# EAGLE design opto_12ch (EAGLE 9.6.2)
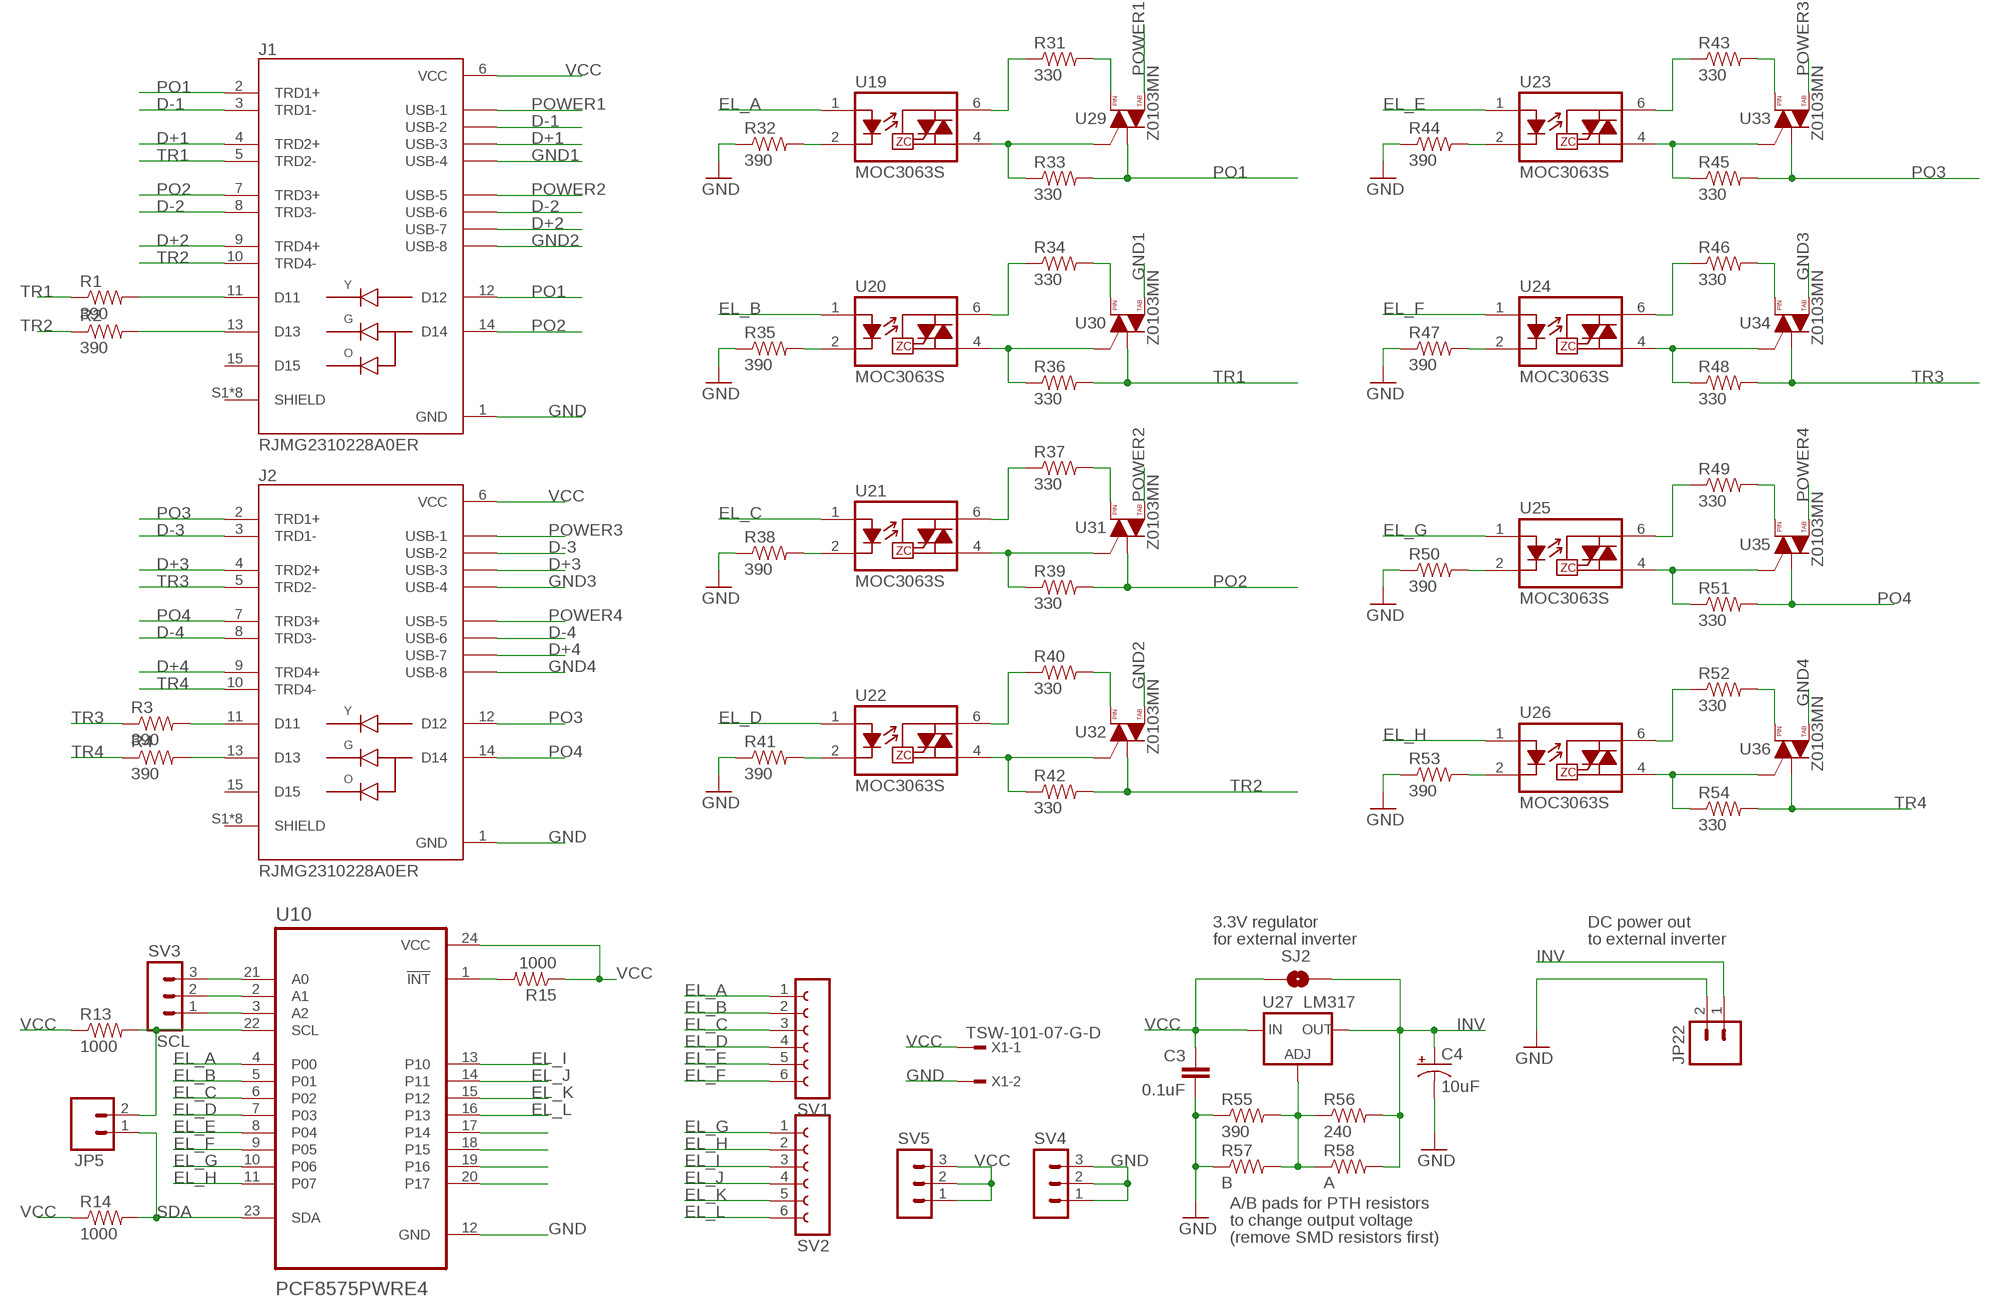
[diagram p0: schematic, sheet 1]

## Parts
C3  0.1uF  CAP0603-CAP  [0603-CAP]
C4  10uF  CAP_POL1206  [EIA3216]
J1  RJMG2310228A0ER  [AMPHENOL_RJMG2310228A0ER]
J2  RJMG2310228A0ER  [AMPHENOL_RJMG2310228A0ER]
JP5  M02PTH  [1X02]
JP22  M02PTH  [1X02]
R1  390  RESISTOR0603-RES  [0603-RES]
R2  390  RESISTOR0603-RES  [0603-RES]
R3  390  RESISTOR0603-RES  [0603-RES]
R4  390  RESISTOR0603-RES  [0603-RES]
R13  1000  RESISTOR0603-RES  [0603-RES]
R14  1000  RESISTOR0603-RES  [0603-RES]
R15  1000  RESISTOR0603-RES  [0603-RES]
R31  330  RESISTOR0603-RES  [0603-RES]
R32  390  RESISTOR0603-RES  [0603-RES]
R33  330  RESISTOR0603-RES  [0603-RES]
R34  330  RESISTOR0603-RES  [0603-RES]
R35  390  RESISTOR0603-RES  [0603-RES]
R36  330  RESISTOR0603-RES  [0603-RES]
R37  330  RESISTOR0603-RES  [0603-RES]
R38  390  RESISTOR0603-RES  [0603-RES]
R39  330  RESISTOR0603-RES  [0603-RES]
R40  330  RESISTOR0603-RES  [0603-RES]
R41  390  RESISTOR0603-RES  [0603-RES]
R42  330  RESISTOR0603-RES  [0603-RES]
R43  330  RESISTOR0603-RES  [0603-RES]
R44  390  RESISTOR0603-RES  [0603-RES]
R45  330  RESISTOR0603-RES  [0603-RES]
R46  330  RESISTOR0603-RES  [0603-RES]
R47  390  RESISTOR0603-RES  [0603-RES]
R48  330  RESISTOR0603-RES  [0603-RES]
R49  330  RESISTOR0603-RES  [0603-RES]
R50  390  RESISTOR0603-RES  [0603-RES]
R51  330  RESISTOR0603-RES  [0603-RES]
R52  330  RESISTOR0603-RES  [0603-RES]
R53  390  RESISTOR0603-RES  [0603-RES]
R54  330  RESISTOR0603-RES  [0603-RES]
R55  390  RESISTOR0603-RES  [0603-RES]
R56  240  RESISTOR0603-RES  [0603-RES]
R57  B  RESISTORPTH-1/4W  [AXIAL-0.4]
R58  A  RESISTORPTH-1/4W  [AXIAL-0.4]
SJ2  SOLDERJUMPERNO  [SJ_2S-NO]
SV1  FE06-1  [FE06]
SV2  FE06-1  [FE06]
SV3  MA03-1  [MA03-1]
SV4  MA03-1  [MA03-1]
SV5  MA03-1  [MA03-1]
U10  PCF8575PWRE4  [SOP65P640X120-24N]
U19  MOC3063S  [DIP8SMD]
U20  MOC3063S  [DIP8SMD]
U21  MOC3063S  [DIP8SMD]
U22  MOC3063S  [DIP8SMD]
U23  MOC3063S  [DIP8SMD]
U24  MOC3063S  [DIP8SMD]
U25  MOC3063S  [DIP8SMD]
U26  MOC3063S  [DIP8SMD]
U27  LM317  V_REG_317DPACK  [V-REG_DPACK]
U29  Z0103MN  TRIACSMD  [SOT223]
U30  Z0103MN  TRIACSMD  [SOT223]
U31  Z0103MN  TRIACSMD  [SOT223]
U32  Z0103MN  TRIACSMD  [SOT223]
U33  Z0103MN  TRIACSMD  [SOT223]
U34  Z0103MN  TRIACSMD  [SOT223]
U35  Z0103MN  TRIACSMD  [SOT223]
U36  Z0103MN  TRIACSMD  [SOT223]
X1  TSW-101-07-G-D  [TSW-101-XX-G-D]

## Nets
D+1: J1.4(TRD2+) J1.U13(USB-3)
D+2: J1.9(TRD4+) J1.U23(USB-7)
D+3: J2.4(TRD2+) J2.U13(USB-3)
D+4: J2.9(TRD4+) J2.U23(USB-7)
D-1: J1.3(TRD1-) J1.U12(USB-2)
D-2: J1.8(TRD3-) J1.U22(USB-6)
D-3: J2.3(TRD1-) J2.U12(USB-2)
D-4: J2.8(TRD3-) J2.U22(USB-6)
EL_A: SV1.1 U10.4(P00) U19.1(A)
EL_B: SV1.2 U10.5(P01) U20.1(A)
EL_C: SV1.3 U10.6(P02) U21.1(A)
EL_D: SV1.4 U10.7(P03) U22.1(A)
EL_E: SV1.5 U10.8(P04) U23.1(A)
EL_F: SV1.6 U10.9(P05) U24.1(A)
EL_G: SV2.1 U10.10(P06) U25.1(A)
EL_H: SV2.2 U10.11(P07) U26.1(A)
EL_I: SV2.3 U10.13(P10)
EL_J: SV2.4 U10.14(P11)
EL_K: SV2.5 U10.15(P12)
EL_L: SV2.6 U10.16(P13)
GND: C3.2 C4.C(-) J1.1(GND) J2.1(GND) JP22.2 R32.1 R35.1 R38.1 R41.1 R44.1 R47.1 R50.1 R53.1 R55.1 R57.P$1 SV4.1 SV4.2 SV4.3 U10.12(GND) X1.2
GND1: J1.U14(USB-4) U30.4(T2)
GND2: J1.U24(USB-8) U32.4(T2)
GND3: J2.U14(USB-4) U34.4(T2)
GND4: J2.U24(USB-8) U36.4(T2)
INV: C4.A(+) JP22.1 R56.2 R58.P$2 SJ2.2 U27.4(OUT)
N$18: J2.11(D11) R3.2
N$19: J2.13(D13) R4.2
N$23: SV3.3 U10.21(A0)
N$24: SV3.2 U10.2(A1)
N$25: SV3.1 U10.3(A2)
N$26: R15.2 U10.1(!INT)
N$27: J1.11(D11) R1.2
N$28: J1.13(D13) R2.2
N$39: U10.17(P14)
N$40: U10.18(P15)
N$41: U10.19(P16)
N$42: U10.20(P17)
N$44: R33.1 U19.4(T2) U29.3(G)
N$45: R32.2 U19.2(K)
N$46: R31.1 U19.6(T1)
N$48: R36.1 U20.4(T2) U30.3(G)
N$49: R35.2 U20.2(K)
N$50: R34.1 U20.6(T1)
N$52: R39.1 U21.4(T2) U31.3(G)
N$53: R38.2 U21.2(K)
N$54: R37.1 U21.6(T1)
N$56: R42.1 U22.4(T2) U32.3(G)
N$57: R41.2 U22.2(K)
N$58: R40.1 U22.6(T1)
N$60: R45.1 U23.4(T2) U33.3(G)
N$61: R44.2 U23.2(K)
N$62: R43.1 U23.6(T1)
N$64: R48.1 U24.4(T2) U34.3(G)
N$65: R47.2 U24.2(K)
N$66: R46.1 U24.6(T1)
N$68: R51.1 U25.4(T2) U35.3(G)
N$69: R50.2 U25.2(K)
N$70: R49.1 U25.6(T1)
N$72: R54.1 U26.4(T2) U36.3(G)
N$73: R53.2 U26.2(K)
N$74: R52.1 U26.6(T1)
N$76: R55.2 R56.1 R57.P$2 R58.P$1 U27.1(ADJ)
N$77: R31.2 U29.2(T2)
N$78: R34.2 U30.2(T2)
N$79: R37.2 U31.2(T2)
N$80: R40.2 U32.2(T2)
N$81: R43.2 U33.2(T2)
N$82: R46.2 U34.2(T2)
N$83: R49.2 U35.2(T2)
N$84: R52.2 U36.2(T2)
PO1: J1.2(TRD1+) J1.12(D12) R33.2 U29.1(T1)
PO2: J1.7(TRD3+) J1.14(D14) R39.2 U31.1(T1)
PO3: J2.2(TRD1+) J2.12(D12) R45.2 U33.1(T1)
PO4: J2.7(TRD3+) J2.14(D14) R51.2 U35.1(T1)
POWER1: J1.U11(USB-1) U29.4(T2)
POWER2: J1.U21(USB-5) U31.4(T2)
POWER3: J2.U11(USB-1) U33.4(T2)
POWER4: J2.U21(USB-5) U35.4(T2)
SCL: JP5.2 R13.2 U10.22(SCL)
SDA: JP5.1 R14.2 U10.23(SDA)
TR1: J1.5(TRD2-) R1.1 R36.2 U30.1(T1)
TR2: J1.10(TRD4-) R2.1 R42.2 U32.1(T1)
TR3: J2.5(TRD2-) R3.1 R48.2 U34.1(T1)
TR4: J2.10(TRD4-) R4.1 R54.2 U36.1(T1)
VCC: C3.1 J1.6(VCC) J2.6(VCC) R13.1 R14.1 R15.1 SJ2.1 SV5.1 SV5.2 SV5.3 U10.24(VCC) U27.3(IN) X1.1
Unconnected: J1.15(D15) J1.S1(SHIELD) J1.S2(SHIELD) J1.S3(SHIELD) J1.S4(SHIELD) J1.S5(SHIELD) J1.S6(SHIELD) J1.S7(SHIELD) J1.S8(SHIELD) J2.15(D15) J2.S1(SHIELD) J2.S2(SHIELD) J2.S3(SHIELD) J2.S4(SHIELD) J2.S5(SHIELD) J2.S6(SHIELD) J2.S7(SHIELD) J2.S8(SHIELD)

## Notes on the sheet
- 3.3V regulator | DC power out
- for external inverter | to external inverter
- A/B pads for PTH resistors
- to change output voltage
- (remove SMD resistors first)

## Library data of the parts
C3 = SparkFun:CAP: Capacitor Standard 0603 ceramic capacitor, and 0.1" leaded capacitor.
C4 = SparkFun:CAP_POL: Capacitor Polarized These are standard SMD and PTH capacitors. Normally 10uF, 47uF, and 100uF in electrolytic and tantalum varieties. Always verify the external diameter of the through hole cap, it varies with capacity, voltage, and manufacturer. The EIA devices should be standard.
J1 J2 = RJMG2310228A0ER:RJMG2310228A0ER: Check availability <https://pricing.snapeda.com/parts/RJMG2310228A0ER/Amphenol%20ICC/view-part?ref=eda>; AVAILABILITY: In Stock; DESCRIPTION: RJ Magnetic (RJMG) - Stacked, Input Output Connectors, Right angle, dip type, RJ45 + Over Dual USB 2.0,1000 baseT,Green/Green-Orange; MF: Amphenol ICC; MP: RJMG2310228A0ER; PACKAGE: None; PRICE: None; PURCHASE-URL: https://pricing.snapeda.com/search/part/RJMG2310228A0ER/?ref=eda
JP5 JP22 = SparkFun:M02: Header 2 Standard 2-pin 0.1" header. Use with straight break away headers (SKU : PRT-00116), right angle break away headers (PRT-00553), swiss pins (PRT-00743), machine pins (PRT-00117), and female headers (PRT-00115). Molex polarized connector foot print use with SKU : PRT-08233 with associated crimp pins and housings.
R1-R4 R13-R15 R31-R58 = SparkFun:RESISTOR: Resistor Basic schematic elements and footprints for 0603, 1206, and PTH resistors.
SJ2 = SparkFun:SOLDERJUMPER: Solder Jumper Standard SMD solder jumper. Used to automate production. Two varients : Normally Open and Normally Closed are the same, but have different paste layers. NC will have a large amount of paste and should jumper during reflow.
SV1 SV2 = con-lsta:FE06-1: FEMALE HEADER; OC_FARNELL: unknown; OC_NEWARK: unknown
SV3-SV5 = con-lstb:MA03-1: PIN HEADER; OC_FARNELL: unknown; OC_NEWARK: unknown
U10 = PCF8575PWRE4:PCF8575PWRE4: Check availability <https://pricing.snapeda.com/parts/PCF8575PWRE4/Texas%20Instruments/view-part?ref=eda>; AVAILABILITY: In Stock; DESCRIPTION: Remote 16-Bit I2C and SMBus I/O Expander with Interrupt Output 24-TSSOP -40 to 85; MF: Texas Instruments; MP: PCF8575PWRE4; PACKAGE: TSSOP-24 Texas Instruments; PRICE: None; PURCHASE-URL: https://pricing.snapeda.com/search/part/PCF8575PWRE4/?ref=eda
U19-U26 = mike-temp:MOC3063*: Optotriac in DIP and SMD LED: Vf: 1.2V If: 5 mA TRIAC Vdrm: 600V Itsm: 1A Viso: 5000V DV/dt: 1500V/us DIP: MOC3063 SMD: MOC3063S
U27 = SparkFun:V_REG_317: Voltage Regulator Standard LM317 adjustable voltage regulator. AOI (Adjust Output Input). Google 'LM317 Calculator' for easy to use app to get the two resistor values needed. 240/720 for 5V output. 240/390 for 3.3V output. Spark Fun Electronics SKU : COM-00527
U29-U36 = mike-temp:TRIAC
X1 = con-samtec:TSW-101-*-G: THROUGH-HOLE .025" SQ POST HEADER Source: Samtec TSW.pdf; MF: Samtec Inc.; MPN: TSW-101-07-G-D

## Net classes
0 Default: width 0.203 mm

## Board
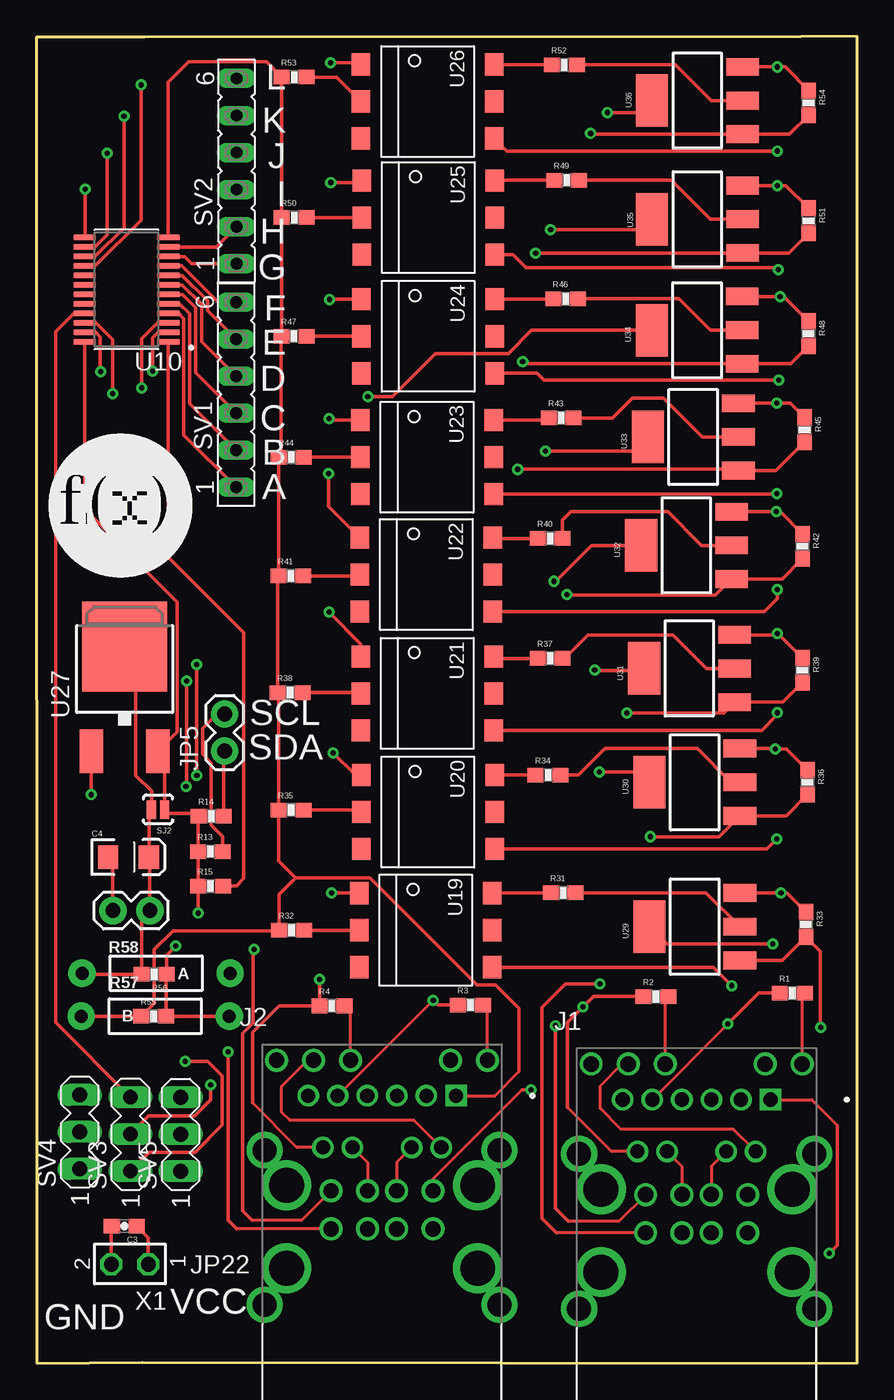
[diagram p1: board, top side]
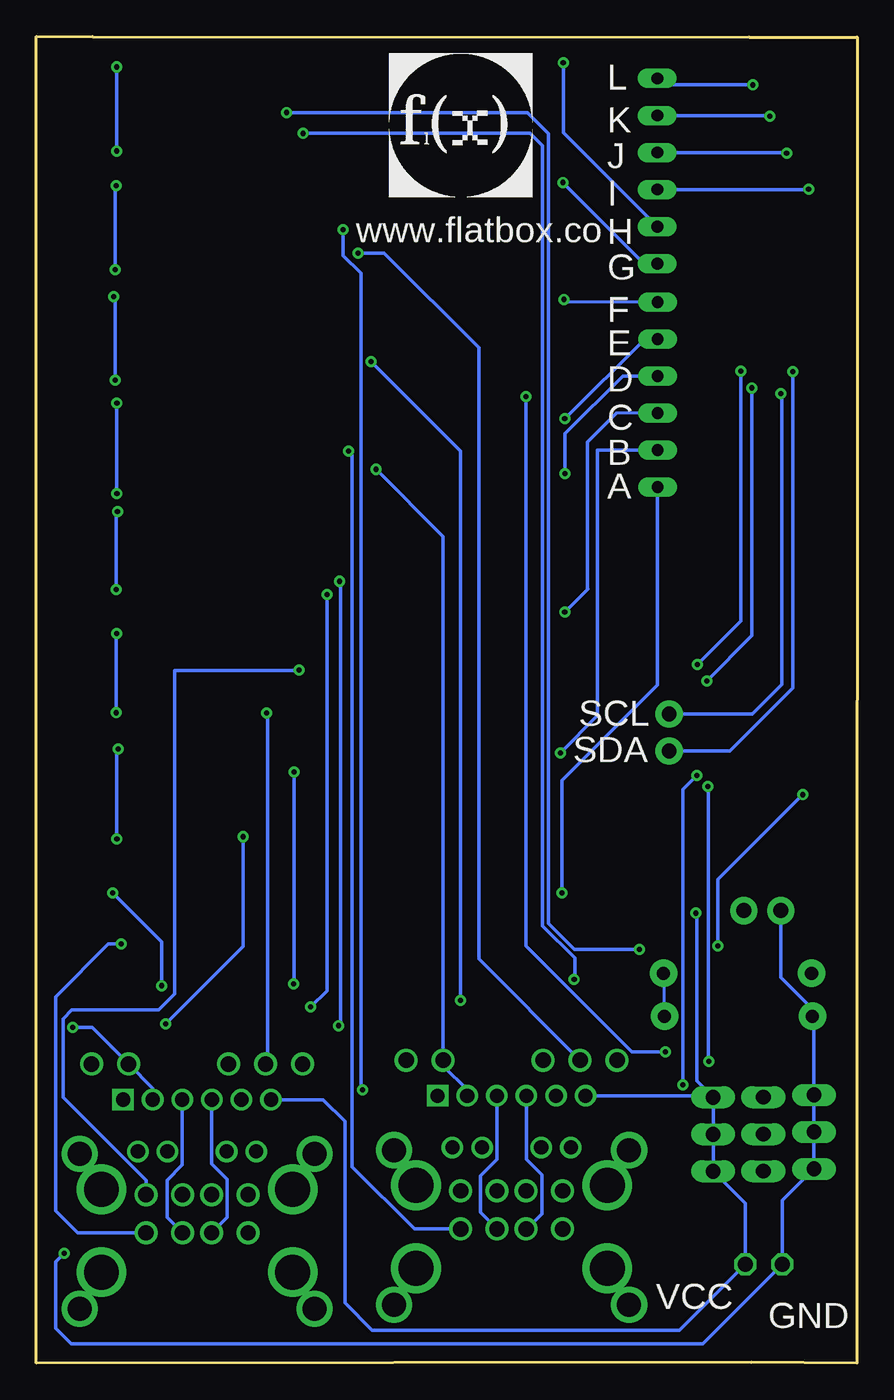
[diagram p2: board, bottom side, seen from below]

Size 56.34 x 91.03 mm. Coordinates in mm from the lower left corner, seen from the top.
Outline: 56.34,0 56.34,91.03 52.48,91.02 7.42,91 0,91 0.03,0 7.28,0.05 56.34,0
Copper layers (1*16): Top 0.035mm / dielectric 1.5mm / Bottom 0.035mm
Design rules "default": minimum track width 6mil, minimum drill 0.35mm, track to track 6mil, track to pad 6mil, pad to pad 6mil, via to via 6mil, smd to smd 6mil, copper to edge 40mil, drill to drill 6mil, minimum pad ring 10mil, minimum via ring 8mil, stop-mask expansion 4mil, vias tented up to drill 0mil, thermal gap 10mil

### Footprints (pad centres in the part's own frame; a part is rotated, then mirrored left to right if it is on the bottom)
0603-CAP = smd 1.1 x 1: 1 -0.85,0; 2 0.85,0
EIA3216 = smd 1.4 x 1.6: A 1.4,0; C -1.4,0
AMPHENOL_RJMG2310228A0ER = drill 0.97 square: 1 5.075,6.15 | drill 0.97: 2 3.045,6.15; 3 1.015,6.15; 4 -1.015,6.15; 5 -3.045,6.15; 6 -5.075,6.15; 7 4.06,2.6; 8 2.03,2.6; 9 -2.03,2.6; 10 -4.06,2.6 | drill 1.05: 11 7.24,8.59; 12 4.7,8.59; 13 -2.16,8.59; 14 -4.7,8.59; 15 -7.24,8.59; U11 3.5,-2.99; U12 1,-2.99; U13 -1,-2.99; U14 -3.5,-2.99; U21 3.5,-0.37; U22 1,-0.37; U23 -1,-0.37; U24 -3.5,-0.37 | drill 1.65 pad 2: S1 -8.065,-8.2; S2 8.065,-8.2; S3 -8.065,2.42; S4 8.065,2.42 | drill 2.39 pad 2.74: S5 -6.565,-5.69; S6 6.565,-5.69; S7 -6.565,0; S8 6.565,0
1X02 = drill 1.016 pad 1.88: 1 0,0; 2 2.54,0
0603-RES = smd 1.1 x 1: 1 -0.85,0; 2 0.85,0
AXIAL-0.4 = drill 0.9 pad 1.88: P$1 -5.08,0; P$2 5.08,0
SJ_2S-NO = smd 0.635 x 1.27: 1 -0.45,0; 2 0.45,0
FE06 = drill 0.813 long: 1 -6.35,0; 2 -3.81,0; 3 -1.27,0; 4 1.27,0; 5 3.81,0; 6 6.35,0
MA03-1 = drill 1.016 long: 1 -2.54,0; 2 0,0; 3 2.54,0
SOP65P640X120-24N = smd 1.57 x 0.41: 1 -2.87,3.575; 2 -2.87,2.925; 3 -2.87,2.275; 4 -2.87,1.625; 5 -2.87,0.975; 6 -2.87,0.325; 7 -2.87,-0.325; 8 -2.87,-0.975; 9 -2.87,-1.625; 10 -2.87,-2.275; 11 -2.87,-2.925; 12 -2.87,-3.575; 13 2.87,-3.575; 14 2.87,-2.925; 15 2.87,-2.275; 16 2.87,-1.625; 17 2.87,-0.975; 18 2.87,-0.325; 19 2.87,0.325; 20 2.87,0.975; 21 2.87,1.625; 22 2.87,2.275; 23 2.87,2.925; 24 2.87,3.575
DIP8SMD = smd 1.524 x 1.27: 1 -2.54,-4.572; 2 0,-4.572; 3 2.54,-4.572; 4 2.54,4.572; 5 0,4.572; 6 -2.54,4.572
V-REG_DPACK = smd 1.6 x 3: 1 -2.28,-4.8; 3 2.28,-4.8 | smd 5.8 x 6.2: 4 0,2.38
SOT223 = smd 1.219 x 2.235: 1 -2.311,-3.099; 2 0,-3.099; 3 2.311,-3.099 | smd 3.6 x 2.2: 4 0,3.099
TSW-101-XX-G-D = drill 1 pad 1.5 octagon: 1 0.02,-1.27; 2 0.02,1.27

### Placement (x,y rotation side)
C3  6.03,9.41 180 top
C4  6.32,34.72 0 top
J1  45.31,11.93 0 top
J2  23.72,12.19 0 top
JP5  12.92,42 90 top
JP22  7.79,31.05 180 top
R1  51.88,25.39 0 top
R2  42.52,25.15 0 top
R3  29.79,24.57 0 top
R4  20.28,24.51 0 top
R13  11.94,35.1 0 top
R14  12,37.53 0 top
R15  11.95,32.73 0 top
R31  36.16,32.27 0 top
R32  17.51,29.71 0 top
R33  52.82,30.1 270 top
R34  35.12,40.35 0 top
R35  17.48,37.95 0 top
R36  52.92,39.85 270 top
R37  35.27,48.36 0 top
R38  17.41,46.01 0 top
R39  52.58,47.54 270 top
R40  35.27,56.59 0 top
R41  17.46,54.01 0 top
R42  52.58,56.05 270 top
R43  36.02,64.86 0 top
R44  17.49,62.15 0 top
R45  52.72,64.05 270 top
R46  36.32,73.03 0 top
R47  17.68,70.46 0 top
R48  52.98,70.64 270 top
R49  36.4,81.17 0 top
R50  17.69,78.61 0 top
R51  53,78.38 270 top
R52  36.23,89.08 0 top
R53  17.69,88.24 0 top
R54  53,86.47 270 top
R55  8.05,23.8 0 top
R56  8.08,26.68 180 top
R57  8.15,23.8 0 top
R58  8.22,26.75 180 top
SJ2  8.34,37.99 180 top
SV1  13.7,66.46 90 top
SV2  13.73,81.8 90 top
SV3  6.45,15.71 90 top
SV4  2.97,15.86 90 top
SV5  9.89,15.7 90 top
U10  6.18,73.66 180 top
U19  26.72,29.71 270 top
U20  26.87,37.81 270 top
U21  26.82,45.95 270 top
U22  26.76,54.11 270 top
U23  26.81,62.16 270 top
U24  26.89,70.46 270 top
U25  26.9,78.6 270 top
U26  26.85,86.57 270 top
U27  6.06,46.79 0 top
U29  45.18,29.95 90 top
U30  45.18,39.85 90 top
U31  44.81,47.66 90 top
U32  44.6,56.11 90 top
U33  45.07,63.55 90 top
U34  45.34,70.88 90 top
U35  45.35,78.49 90 top
U36  45.35,86.63 90 top
X1  6.41,6.76 90 top

### Tracks (layer width: path | path; a pad name or v marks a point on that pad's centre or on a via)
D+1
  Bottom 0.254: J1.4 44.3,14.95 44.3,13.66 43.25,12.61 43.25,10 J1.U13
D+2
  Top 0.203: J1.9 44.31,13.49 J1.U23
D+3
  Bottom 0.254: J2.U13 22.69,9.2 21.66,10.24 21.66,12.91 22.71,13.97 J2.4
D+4
  Top 0.203: J2.9 22.72,13.76 J2.U23
D-1
  Bottom 0.254: J1.3 46.33,14.95 46.33,13.61 47.38,12.56 47.38,10 J1.U12
D-2
  Top 0.203: J1.8 46.31,13.49 J1.U22
D-3
  Bottom 0.254: J2.U12 25.87,10.34 25.87,12.85 24.74,13.98 J2.3
D-4
  Top 0.203: J2.8 24.72,13.76 J2.U22
EL_A  (via drill 0.35)
  Top 0.254: U10.4 9.08,72.01 9.79,72.01 10.12,71.68 10.12,63.69 SV1.1 | U19.1 20.27,32.24 v20.26,32.26
  Bottom 0.254: SV1.1 13.7,46.52 20.26,39.96 v20.26,32.26
EL_B  (via drill 0.35)
  Top 0.254: SV1.2 10.53,65.83 10.53,72 9.81,72.71 9.08,72.71 U10.5 | U20.1 21.89,40.35 v20.37,41.87
  Bottom 0.254: SV1.2 17.82,62.65 17.82,44.42 v20.37,41.87
EL_C  (via drill 0.35)
  Top 0.254: SV1.3 10.93,67.96 10.93,72.42 10.04,73.31 9.08,73.31 U10.6 | U21.1 22.25,49.35 v20.08,51.52
  Bottom 0.203: SV1.3 16.52,65.19 | 18.5,53.14 18.48,53.12
  Bottom 0.254: 18.48,53.12 v20.08,51.52 | 16.52,65.19 18.5,63.21 18.5,53.14
EL_D  (via drill 0.35)
  Top 0.254: SV1.4 11.34,70.09 11.34,72.65 10.02,73.97 9.07,73.97 U10.7 | v20.05,61.05 20.05,58.78 U22.1
  Bottom 0.254: SV1.4 16.09,67.73 20.06,63.76 v20.06,61.05 v20.05,61.05
EL_E  (via drill 0.35)
  Top 0.254: SV1.5 11.74,72.23 11.74,72.89 10,74.63 U10.8 | U23.1 20.18,64.7 v20.08,64.81
  Bottom 0.254: v20.08,64.81 20.05,64.81 14.59,70.27 SV1.5
EL_F  (via drill 0.35)
  Top 0.254: SV1.6 12.48,72.81 9.98,75.31 9.08,75.31 U10.9 | U24.1 20.14,73 v20.13,72.99
  Bottom 0.203: SV1.6 19.95,72.81 v20.13,72.99
  Bottom 0.254: v20.13,72.99 20.13,73.14
EL_G  (via drill 0.35)
  Top 0.254: SV2.1 10.64,75.45 10.16,75.93 U10.10 | U25.1 22.2,81.01 v20.21,81.01
  Bottom 0.254: v20.21,81.01 14.64,75.45 SV2.1
EL_H  (via drill 0.35)
  Top 0.254: SV2.2 12.32,76.58 U10.11 | U26.1 22.15,89.23 v20.18,89.23
  Bottom 0.254: v20.18,89.23 20.18,84.44 SV2.2
EL_I  (via drill 0.35)
  Top 0.254: v3.34,80.54 3.34,77.26 U10.13
  Bottom 0.254: SV2.3 3.35,80.53 v3.34,80.54
EL_J  (via drill 0.35)
  Top 0.254: U10.14 3.34,76.56 4,76.56 4.85,77.42 v4.85,83.03
  Bottom 0.254: SV2.4 4.89,83.07 v4.85,83.03
EL_K  (via drill 0.35)
  Top 0.254: U10.15 3.33,75.92 4.01,75.92 6.01,77.92 v6.01,85.56
  Bottom 0.254: SV2.5 6.06,85.61 v6.01,85.56
EL_L  (via drill 0.35)
  Top 0.254: U10.16 3.33,75.3 4.03,75.3 7.18,78.44 v7.18,87.71
  Bottom 0.254: SV2.6 13.28,87.71 v7.18,87.71
GND  (via drill 0.35)
  Top 0.203: J2.1 31.46,18.34 33.13,20.01 | J1.1 53.22,18.07 54.98,16.32 | 16.83,78.6 R50.1
  Top 0.254: X1.2 5.14,9.37 C3.2 | R57.P$1 R55.1 8.1,24.7 8.1,28.37 9.39,29.66 16.62,29.66 R32.1 16.66,32.15 17.8,33.29 | JP22.2 5.25,34.4 C4.C | R50.1 R53.1 15.8,89.28 10.44,89.28 9.05,87.9 U10.12 | 33.13,20.01 33.13,24.35 31.52,25.96 30.23,25.96 22.9,33.29 17.8,33.29 | 17.8,33.29 16.63,34.46 R35.1 16.63,45.94 R38.1 16.56,53.96 R41.1 16.61,62.13 R44.1 16.8,62.32 16.8,70.44 R47.1 16.83,78.6 | 54.98,16.32 54.98,8.09 v54.42,7.53
  Bottom 0.254: JP22.2 5.25,26.48 3.07,24.31 R57.P$1 2.97,23.7 SV4.3 SV4.2 SV4.1 5.14,11.15 X1.2 10.59,1.33 53.95,1.33 55,2.39 55,6.95 v54.42,7.53
GND1  (via drill 0.35)
  Top 0.203: J1.U14 35.71,8.93
  Top 0.254: U30.4 41.37,40.56 v38.65,40.56 | v38.68,26.01 36.32,26.01 34.71,24.4 34.71,9.93 35.71,8.93
  Bottom 0.254: v38.65,40.56 38.65,26.05 v38.68,26.01
GND2  (via drill 0.35)
  Top 0.203: J1.U24 39.97,9.72 36.53,9.72
  Top 0.254: U32.4 38.1,56.11 35.64,53.64 v35.52,53.64 | 36.53,9.72 35.61,10.63 v35.61,23.15
  Bottom 0.254: v35.52,53.64 35.46,53.58 35.46,23.3 v35.61,23.15
GND3  (via drill 0.35)
  Top 0.203: J2.U14 13.75,9.2
  Top 0.254: U34.4 33.99,70.88 32.39,69.28 27.41,69.28 24.43,66.31 v22.75,66.31 | 13.75,9.2 13.17,9.78 v13.17,21.35
  Bottom 0.254: v13.17,21.35 13.18,21.34 15.48,21.34 22.75,28.61 v22.75,66.31
GND4  (via drill 0.35)
  Top 0.203: J2.U24 18.19,9.79 14.8,9.79
  Top 0.254: U36.4 41.44,85.81 v39.18,85.81 | v14.95,28.38 14.88,28.32 14.88,23.36 14.14,22.62 14.14,10.45 14.8,9.79
  Bottom 0.254: v39.18,85.81 22.64,85.81 21.21,84.38 21.21,30.18 19.41,28.38 v14.95,28.38
INV
  Top 0.254: R58.P$2 3.2,26.68 R56.2 7.23,30.49 JP22.1 7.79,34.66 C4.A 7.72,37.82 SJ2.2 7.89,39.24 6.83,40.31 6.83,48.4 U27.4
N$18
  Top 0.203: J2.11 30.96,24.25 R3.2
N$19
  Top 0.203: J2.13 21.56,24.08
  Top 0.254: 21.56,24.08 R4.2
N$23
  Top 0.254: SV3.3 1.32,23.38 1.32,70.77 2.58,72.03 U10.21 | U10.21
N$24  (via drill 0.35)
  Top 0.254: SV3.2 7.7,16.95 10.85,16.95 11.96,18.07 v11.96,19.1 | v11.01,40.31 10.99,40.33 v10.99,47.93 v10.98,47.93 | v7.99,68.06 7.99,70.38 8.35,70.73 U10.2 | U10.2
  Bottom 0.254: v11.96,19.1 11.96,39.36 v11.01,40.31 | v10.98,47.93 7.99,50.92 v7.99,68.06
N$25  (via drill 0.35)
  Top 0.254: U10.3 9.04,71.4 8.31,71.4 7.23,70.31 v7.23,66.92 | v10.32,46.81 10.32,39.63 v10.26,39.57 | SV3.1 7.75,14.46 10.9,14.46 12.76,16.33 12.76,19.7 11.75,20.71 v10.2,20.71
  Bottom 0.254: v7.23,66.92 7.23,49.91 v10.32,46.81 | v10.26,39.57 10.23,39.54 10.23,20.75 v10.2,20.71
N$26
  Top 0.254: U10.1 9.04,70.07 9.04,55.33 14.24,50.13 14.24,33.24 13.73,32.73 R15.2
N$27
  Top 0.203: J1.11 52.55,25.21 52.72,25.37
  Top 0.254: 52.63,25.29 52.72,25.37 R1.2
N$28
  Top 0.203: J1.13 43.15,24.93
  Top 0.254: 43.15,24.93 R2.2
N$44  (via drill 0.35)
  Top 0.254: U29.3 v51.1,32.26 51.51,32.26 R33.1 | U19.4 46.47,27.16 v47.74,25.89
  Bottom 0.254: v47.74,25.89 47.74,28.89 v51.1,32.26
N$45
  Top 0.254: R32.2 U19.2
N$46
  Top 0.254: U19.6 35.28,32.24 R31.1
N$48  (via drill 0.35)
  Top 0.254: U30.3 50.7,42.16 v50.72,42.14 51.48,42.14 R36.1 | U20.4 50.12,35.27 v50.81,35.97
  Bottom 0.254: v50.81,35.97 50.81,42.05 v50.72,42.14
N$49
  Top 0.254: R35.2 22.16,37.95 U20.2
N$50
  Top 0.254: R34.1 U20.6
N$52  (via drill 0.35)
  Top 0.254: U31.3 50.75,49.97 v50.84,50.06 50.9,50.06 R39.1 | v50.85,44.63 50.85,44.49 49.78,43.41 U21.4
  Bottom 0.254: v50.85,44.63 50.85,50.05 v50.84,50.06
N$53
  Top 0.254: R38.2 22.2,46.01 U21.2
N$54
  Top 0.254: R37.1 31.53,48.36 U21.6
N$56  (via drill 0.35)
  Top 0.254: U32.3 v50.77,58.42 51.05,58.42 R42.1 | v50.85,53.07 50.85,52.46 49.96,51.57 U22.4
  Bottom 0.254: v50.77,58.42 50.85,58.34 v50.85,53.07
N$57
  Top 0.254: U22.2 22.09,54.01 R41.2
N$58
  Top 0.254: R40.1 31.39,56.59 U22.6
N$60  (via drill 0.35)
  Top 0.254: U33.3 v50.81,65.86 51.75,65.86 R45.1 | v50.81,59.66 50.77,59.62 U23.4
  Bottom 0.254: v50.81,65.86 v50.81,59.66
N$61
  Top 0.254: U23.2 22.23,62.15 R44.2
N$62
  Top 0.254: R43.1 35.01,64.7 U23.6
N$64  (via drill 0.35)
  Top 0.254: U34.3 v51.04,73.19 51.28,73.19 R48.1 | U24.4 34.37,67.92 34.84,67.45 50.93,67.45 v50.94,67.46
  Bottom 0.254: v50.94,67.46 50.94,73.09 v51.04,73.19
N$65
  Top 0.254: R47.2 U24.2
N$66
  Top 0.254: U24.6 35.45,73 R46.1
N$68  (via drill 0.35)
  Top 0.254: U35.3 v50.86,80.8 51.43,80.8 R51.1 | U25.4 32.72,76.06 33.59,75.18 50.77,75.18 v50.93,75.03
  Bottom 0.254: v50.93,75.03 50.93,80.73 v50.86,80.8
N$69
  Top 0.254: R50.2 U25.2
N$70
  Top 0.254: R49.1 31.49,81.17 U25.6
N$72  (via drill 0.35)
  Top 0.254: U36.3 v50.84,88.94 51.38,88.94 R54.1 | U26.4 32.3,83.15 50.81,83.15 v50.84,83.17
  Bottom 0.254: v50.84,83.17 v50.84,88.94
N$73
  Top 0.254: R53.2 20.6,88.24 U26.2
N$74
  Top 0.254: U26.6 35.35,89.11 R52.1
N$76  (via drill 0.35)
  Top 0.254: R57.P$2 R55.2 8.9,26.66 R56.1 8.93,27.99 v9.56,28.63 | v3.75,39 3.75,41.95 U27.1
  Bottom 0.203: R57.P$2 13.23,26.68 R58.P$1
  Bottom 0.254: v9.56,28.63 9.56,33.18 v3.75,39
N$77
  Top 0.254: R31.2 45.95,32.27 U29.2
N$78
  Top 0.254: R34.2 37.19,40.35 39.01,42.16 45.36,42.16 47.67,39.85 U30.2
N$79
  Top 0.254: R37.2 36.26,48.36 37.84,49.95 43.68,49.95 45.96,47.66 U31.2
N$80
  Top 0.254: R40.2 36.12,57.84 36.7,58.42 43.33,58.42 45.63,56.11 U32.2
N$81
  Top 0.254: R43.2 39.53,64.86 40.9,66.23 43.03,66.23 45.71,63.55 U33.2
N$82
  Top 0.254: R46.2 44.11,73.02 46.26,70.88 U34.2
N$83
  Top 0.254: R49.2 43.56,81.17 46.24,78.49 U35.2
N$84
  Top 0.254: R52.2 43.87,89.08 46.32,86.63 U36.2
PO1  (via drill 0.35)
  Top 0.254: U29.1 51.2,27.63 R33.2 53.81,28.25 53.81,23.05 v53.84,23.02
  Bottom 0.254: J1.2 48.36,18.86 J1.12 52.52,23.02 v53.84,23.02
PO2  (via drill 0.35)
  Top 0.203: J1.7 47.85,16.05 40.11,16.05 38.7,17.46 38.7,19.01 40.2,20.51 J1.14
  Top 0.254: R39.2 51.24,45.35 U31.1 47.17,44.61 v40.54,44.61
  Bottom 0.254: v40.54,44.61 40.47,44.55 40.47,20.65 J1.14
PO3  (via drill 0.35)
  Top 0.254: R45.2 50.76,61.24 U33.1 48.08,61.33 v33.03,61.33
  Bottom 0.254: J2.2 26.77,18.74 28.42,20.39 J2.12 28.42,56.72 v33.03,61.33
PO4  (via drill 0.35)
  Top 0.203: J2.7 25.93,16.65 17.4,16.65 16.84,17.21 16.84,19 18.62,20.78 J2.14
  Top 0.254: R51.2 51.64,76.17 U35.1 v34.26,76.17
  Bottom 0.254: J2.14 25.97,27.73 25.97,69.67 32.47,76.17 v34.26,76.17
POWER1  (via drill 0.35)
  Top 0.254: U29.4 43.27,28.75 v50.53,28.75
  Bottom 0.254: v50.53,28.75 51.4,28.75 55.03,25.12 55.03,10.45 53.51,8.93 J1.U11
POWER2  (via drill 0.35)
  Top 0.254: U31.4 41.56,47.51 38.35,47.51 v38.32,47.55
  Bottom 0.254: v38.32,47.55 38.35,47.51 46.85,47.51 46.85,25.34 47.94,24.24 53.9,24.24 54.51,23.63 54.51,18.22 48.81,12.52 J1.U21
POWER3  (via drill 0.35)
  Top 0.254: v34.92,62.57 41,62.57 U33.4
  Bottom 0.254: J2.U11 30.39,9.2 34.66,13.47 34.66,62.31 v34.92,62.57
POWER4  (via drill 0.35)
  Top 0.203: J2.U21 27.22,12.64 33.34,18.76
  Top 0.254: U35.4 41.54,77.77 v35.29,77.77 | 33.34,18.76 v33.95,18.76
  Bottom 0.254: v35.29,77.77 35.29,76 34.07,74.78 34.07,18.88 v33.95,18.76
SCL  (via drill 0.35)
  Top 0.254: R13.2 12.79,36.15 12,36.94 12,41.19 11.4,41.79 11.4,43.54 12.41,44.54 JP5.2 | U10.22 3.33,71.4 4.07,71.4 5.25,70.22 v5.25,66.53
  Bottom 0.254: JP5.2 7.2,44.54 5.18,46.56 5.18,66.47 v5.25,66.53
SDA  (via drill 0.35)
  Top 0.254: R14.2 12.85,41.93 JP5.1 | v4.42,68.05 4.38,68.09 4.38,70.41 4.06,70.73 U10.23
  Bottom 0.254: JP5.1 8.74,42 4.42,46.32 v4.42,68.05
TR1  (via drill 0.35)
  Top 0.203: J1.5 47.36,23.16
  Top 0.254: R36.2 51.46,37.54 U30.1 46.85,36.12 v42.15,36.12 | R1.1 49.58,25.39 v47.47,23.27 47.36,23.16 47.37,23.16
  Bottom 0.254: v47.47,23.27 v47.47,23.29 42.15,28.6 v42.15,36.12
TR2  (via drill 0.35)
  Top 0.203: J1.10 39.48,14.52 36.46,17.54
  Top 0.254: R42.2 51.18,53.8 U32.1 46.61,52.7 36.42,52.7 v36.4,52.73 | 36.46,17.54 36.46,23.39 v37.51,24.44 38.21,25.15 R2.1
  Bottom 0.254: v36.4,52.73 36.4,25.55 v37.51,24.44
TR3  (via drill 0.35)
  Top 0.203: J2.5 v27.24,24.9
  Top 0.254: R48.2 51.76,68.57 U34.1 33.52,68.57 v33.38,68.71 | v27.24,24.9 27.56,24.57 R3.1
  Bottom 0.254: v33.38,68.71 27.24,62.57 v27.24,24.9
TR4  (via drill 0.35)
  Top 0.203: J2.10 17.87,14.79 14.82,17.84
  Top 0.254: R54.2 51.69,84.31 U36.1 38.1,84.31 v38.04,84.38 | 14.82,17.84 14.82,22.68 16.65,24.51 R4.1 v19.43,26.31
  Bottom 0.254: v38.04,84.38 22.45,84.38 21.61,83.54 21.61,30.01 19.39,27.79 19.39,26.35 v19.43,26.31
VCC  (via drill 0.35)
  Top 0.254: X1.1 7.68,8.61 C3.1 | v11.09,30.87 11.09,32.71 R15.1 11.1,35.09 R13.1 11.09,37.46 R14.1 10.96,37.72 9.06,37.72 SJ2.1 8.79,41.53 U27.3 9.66,43.31 9.66,52.23 3.31,58.58 U10.24
  Bottom 0.254: SV5.3 SV5.2 SV5.1 7.68,10.95 X1.1 12.2,2.25 33.29,2.25 35.17,4.13 35.17,16.59 36.66,18.07 J1.6 | J2.6 10,18.34 SV5.3 | SV5.3 11.02,19.37 11.02,30.81 v11.09,30.87

### Text on the board
tPlace: L | K | J | I | H | G | F | E | D | C | B | A | C:/Users/isaac/Desktop/FlatBox/logoPCB1.bmp | SCL | SDA | VCC | GND
bPlace: L | K | J | I | C:/Users/isaac/Desktop/FlatBox/logoPCB_invert.bmp | H | www.flatbox.co | G | F | E | D | C | B | A | SCL | SDA | VCC | GND